# Altium schematic sheet POWER.SchDoc
size 420 x 297 mm; SheetNumber: 4; SheetTotal: 11
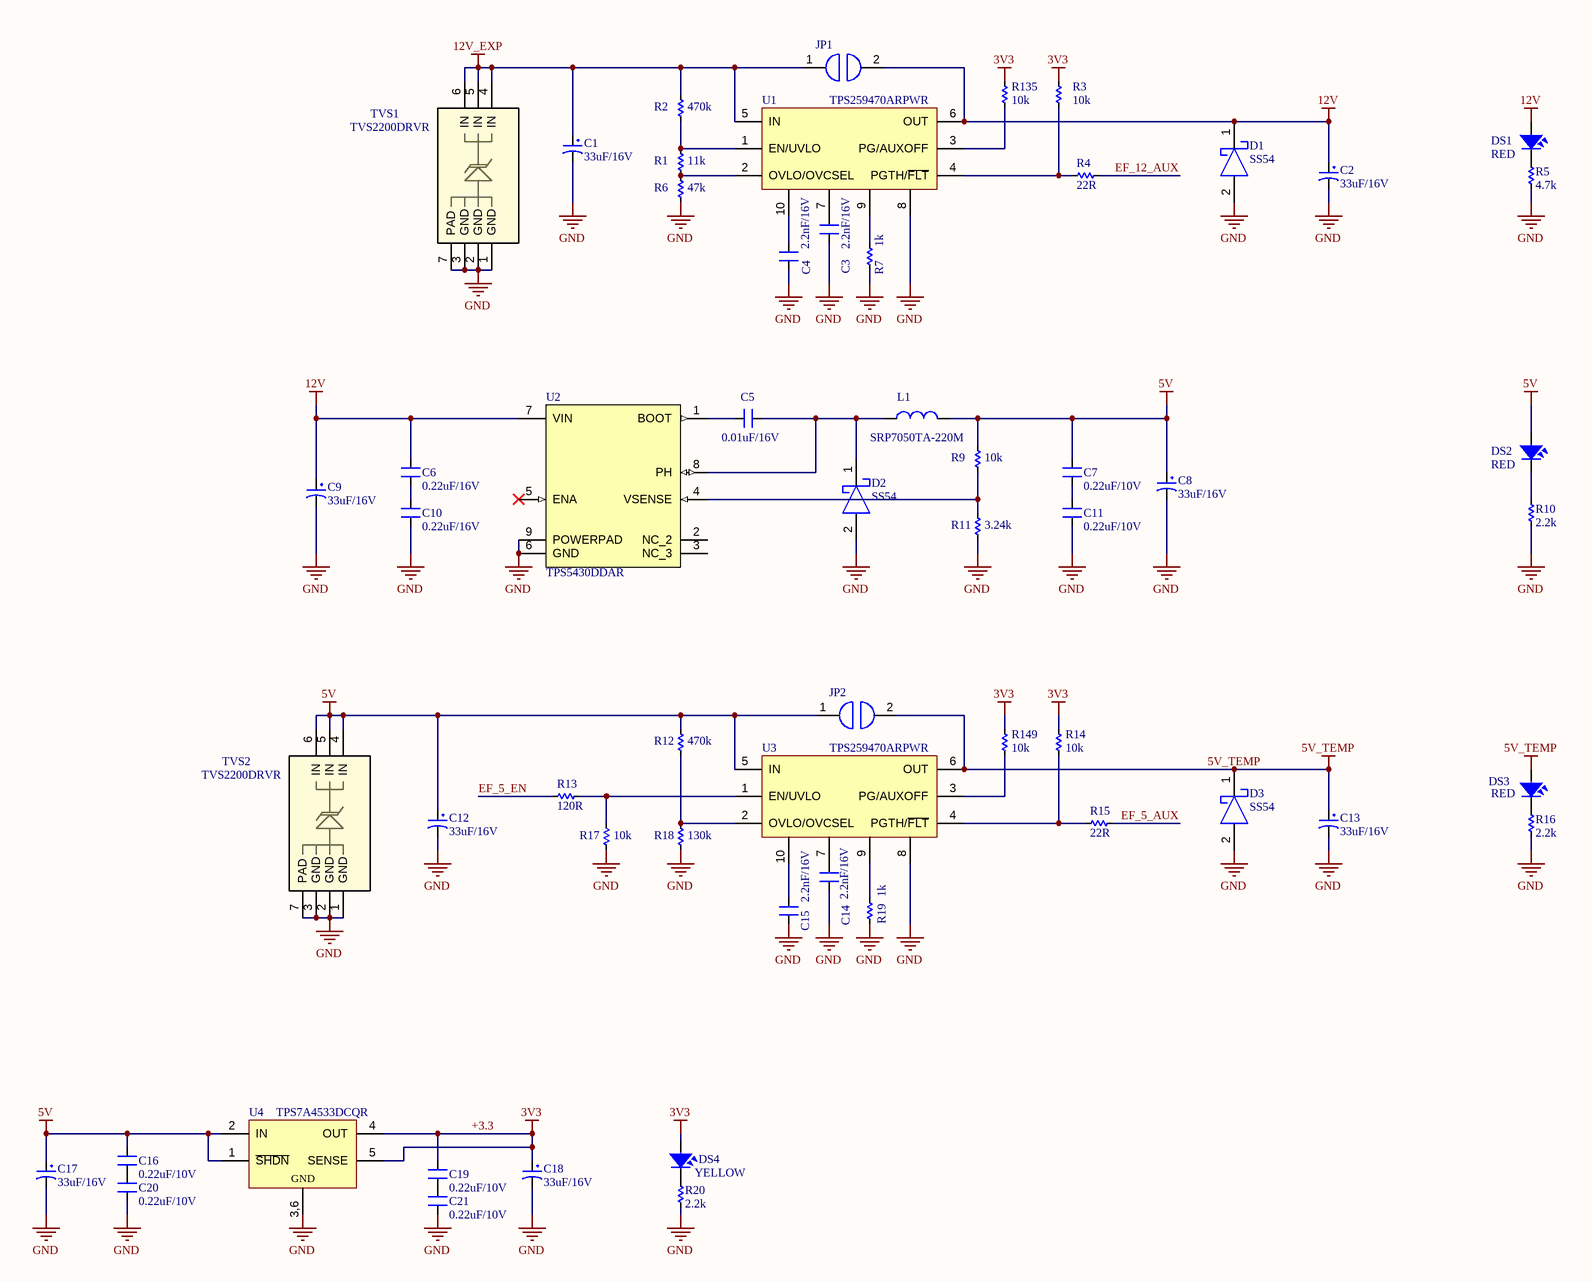
[diagram p0: POWER.SchDoc]

## Parts
C1  33uF/16V  [TANTALUM-SMD-1206]
C2  33uF/16V  [TANTALUM-SMD-1206]
C3  2.2nF/16V  [CAP_C_1608X80]
C4  2.2nF/16V  [CAP_C_1608X80]
C5  0.01uF/16V  [CAP_C_1608X80]
C6  0.22uF/16V  [CAP_C_1608X80]
C7  0.22uF/10V  [CAP_C_1608X80]
C8  33uF/16V  [TANTALUM-SMD-1206]
C9  33uF/16V  [TANTALUM-SMD-1206]
C10  0.22uF/16V  [CAP_C_1608X80]
C11  0.22uF/10V  [CAP_C_1608X80]
C12  33uF/16V  [TANTALUM-SMD-1206]
C13  33uF/16V  [TANTALUM-SMD-1206]
C14  2.2nF/16V  [CAP_C_1608X80]
C15  2.2nF/16V  [CAP_C_1608X80]
C16  0.22uF/10V  [CAP_C_1608X80]
C17  33uF/16V  [TANTALUM-SMD-1206]
C18  33uF/16V  [TANTALUM-SMD-1206]
C19  0.22uF/10V  [CAP_C_1608X80]
C20  0.22uF/10V  [CAP_C_1608X80]
C21  0.22uF/10V  [CAP_C_1608X80]
D1  SS54  [DO214-AC-SMA]
D2  SS54  [DO214-AC-SMA]
D3  SS54  [DO214-AC-SMA]
DS1  RED  [LED-0603-BLUE]
DS2  RED  [LED-0603-BLUE]
DS3  RED  [LED-0603-BLUE]
DS4  YELLOW  [LED-0603-BLUE]
JP1  jumper2  [JUMPER]  (value not drawn)
JP2  jumper2  [JUMPER]  (value not drawn)
L1  SRP7050TA-220M  [PSM6050]
R1  11k  [RES_C_1608X60]
R2  470k  [RES_C_1608X60]
R3  10k  [RES_C_1608X60]
R4  22R  [RES_C_1608X60]
R5  4.7k  [RES_C_1608X60]
R6  47k  [RES_C_1608X60]
R7  1k  [RES_C_1608X60]
R9  10k  [RES_C_1608X60]
R10  2.2k  [RES_C_1608X60]
R11  3.24k  [RES_C_1608X60]
R12  470k  [RES_C_1608X60]
R13  120R  [RES_C_1608X60]
R14  10k  [RES_C_1608X60]
R15  22R  [RES_C_1608X60]
R16  2.2k  [RES_C_1608X60]
R17  10k  [RES_C_1608X60]
R18  130k  [RES_C_1608X60]
R19  1k  [RES_C_1608X60]
R20  2.2k  [RES_C_1608X60]
R135  10k  [RES_C_1608X60]
R149  10k  [RES_C_1608X60]
TVS1  TVS2200DRVR  [TVS2200]
TVS2  TVS2200DRVR  [TVS2200]
U1  TPS259470ARPWR  [VQFN-HR-10]
U2  TPS5430DDAR  [TPS5430DDAR_V3]
U3  TPS259470ARPWR  [VQFN-HR-10]
U4  TPS7A4533DCQR  [SOT223_6]

## Nets
5V: C7.2 C8.1 C12.1 C16.2 C17.1 DS2.1 JP2.1 L1.2 R9.1 R12.1 TVS2.4(IN) TVS2.5(IN) TVS2.6(IN) U3.5(IN) U4.1(~{SHDN}) U4.2(IN)
5V_TEMP: C13.1 D3.1 DS3.1 JP2.2 U3.6(OUT)
12V: C2.1 C6.2 C9.1 D1.1 DS1.1 JP1.2 U1.6(OUT) U2.7(VIN)
12V_EXP: C1.1 JP1.1 R2.1 TVS1.4(IN) TVS1.5(IN) TVS1.6(IN) U1.5(IN)
+3.3: C18.1 C19.2 DS4.1 R3.1 R14.1 R135.1 R149.1 U4.4(OUT) U4.5(SENSE)  [also labelled 3V3]
GND: C1.2 C2.2 C3.1 C4.1 C8.2 C9.2 C10.1 C11.1 C12.2 C13.2 C14.1 C15.1 C17.2 C18.2 C20.1 C21.1 D1.2 D2.2 D3.2 R5.2 R6.2 R7.2 R10.2 R11.2 R16.2 R17.2 R18.2 R19.2 R20.2 TVS1.1(GND) TVS1.2(GND) TVS1.3(GND) TVS1.7(PAD) TVS2.1(GND) TVS2.2(GND) TVS2.3(GND) TVS2.7(PAD) U1.8 U2.6(GND) U2.9(POWERPAD) U3.8 U4.3,6(GND)
EF_5_AUX: R15.2
EF_5_EN: R13.1
EF_12_AUX: R4.2
NetC3_2: C3.2 U1.7
NetC4_2: C4.2 U1.10
NetC5_1: C5.1 D2.1 L1.1 U2.8(PH)
NetC5_2: C5.2 U2.1(BOOT)
NetC6_1: C6.1 C10.2
NetC7_1: C7.1 C11.2
NetC14_2: C14.2 U3.7
NetC15_2: C15.2 U3.10
NetC16_1: C16.1 C20.2
NetC19_1: C19.1 C21.2
NetDS1_2: DS1.2 R5.1
NetDS2_2: DS2.2 R10.1
NetDS3_2: DS3.2 R16.1
NetDS4_2: DS4.2 R20.1
NetR1_1: R1.1 R2.2 U1.1(EN/UVLO)
NetR1_2: R1.2 R6.1 U1.2(OVLO/OVCSEL)
NetR3_2: R3.2 R4.1 U1.4(PGTH/~{FLT})
NetR7_1: R7.1 U1.9
NetR9_2: R9.2 R11.1 U2.4(VSENSE)
NetR12_2: R12.2 R18.1 U3.2(OVLO/OVCSEL)
NetR13_2: R13.2 R17.1 U3.1(EN/UVLO)
NetR14_2: R14.2 R15.1 U3.4(PGTH/~{FLT})
NetR19_1: R19.1 U3.9
NetR135_2: R135.2 U1.3(PG/AUXOFF)
NetR149_2: R149.2 U3.3(PG/AUXOFF)

Not connected (* = marked no-connect by the designer): U2 2(NC_2) 3(NC_3) 5(ENA)*

## Notes on the sheet
- Project:
- BEE-PC1
- Sub-system:
- NANORACK_EXP_CONTROLLER
- Design by:
- SANG HUYNH
- BAO BUI Q.
- Sheet title:
- Sheet
- A3
- of
- Checked by:
- Approved by:
- VU PHAM
- Revision:
- Document No:
- V1.1.1
- Size:
- Date:

## Library data of the parts
C1 C2 C8 C9 C12 C13 C17 C18 = Cap_Tantalum SMD: SMD; Chung_Loai: Dán; Don_Vi: Con; So_Chan: 2; Ten_Linh_Kien: Tụ tantalum 477A-470uF 10V SMD7343; Ma_Hang: MH001956; Kieu_Chan: *
C3-C7 C10 C11 C14-C16 C19-C21 = Capacitors: Value: 33pF
D1-D3 = SS54: DIODE SCHOTTKY 60V 3A DO214AA
DS1-DS4 = LED SMD: Value: LED 3 - 5 ly 2 Colour
JP1 JP2 = JUMPER
L1 = SRP7050TA-220M: FIXED IND 22UH 2.5A 170 MOHM SMD
R1-R7 R9-R20 R135 R149 = Res SMD: SMD; Manufacturer: Generic Components; Class: Passive; Published: 08/06/2000; Publisher: Altium Hobart Technology Centre
TVS1 TVS2 = TVS2200: UNIDIR PRECISION SURGE DIODE
U2 = TPS5430DDAR: IC REG BUCK ADJ 3A 8SOPWR
U4 = TPS7A4533DCQR: IC REG LINEAR 3.3V 1.5A SOT223-6